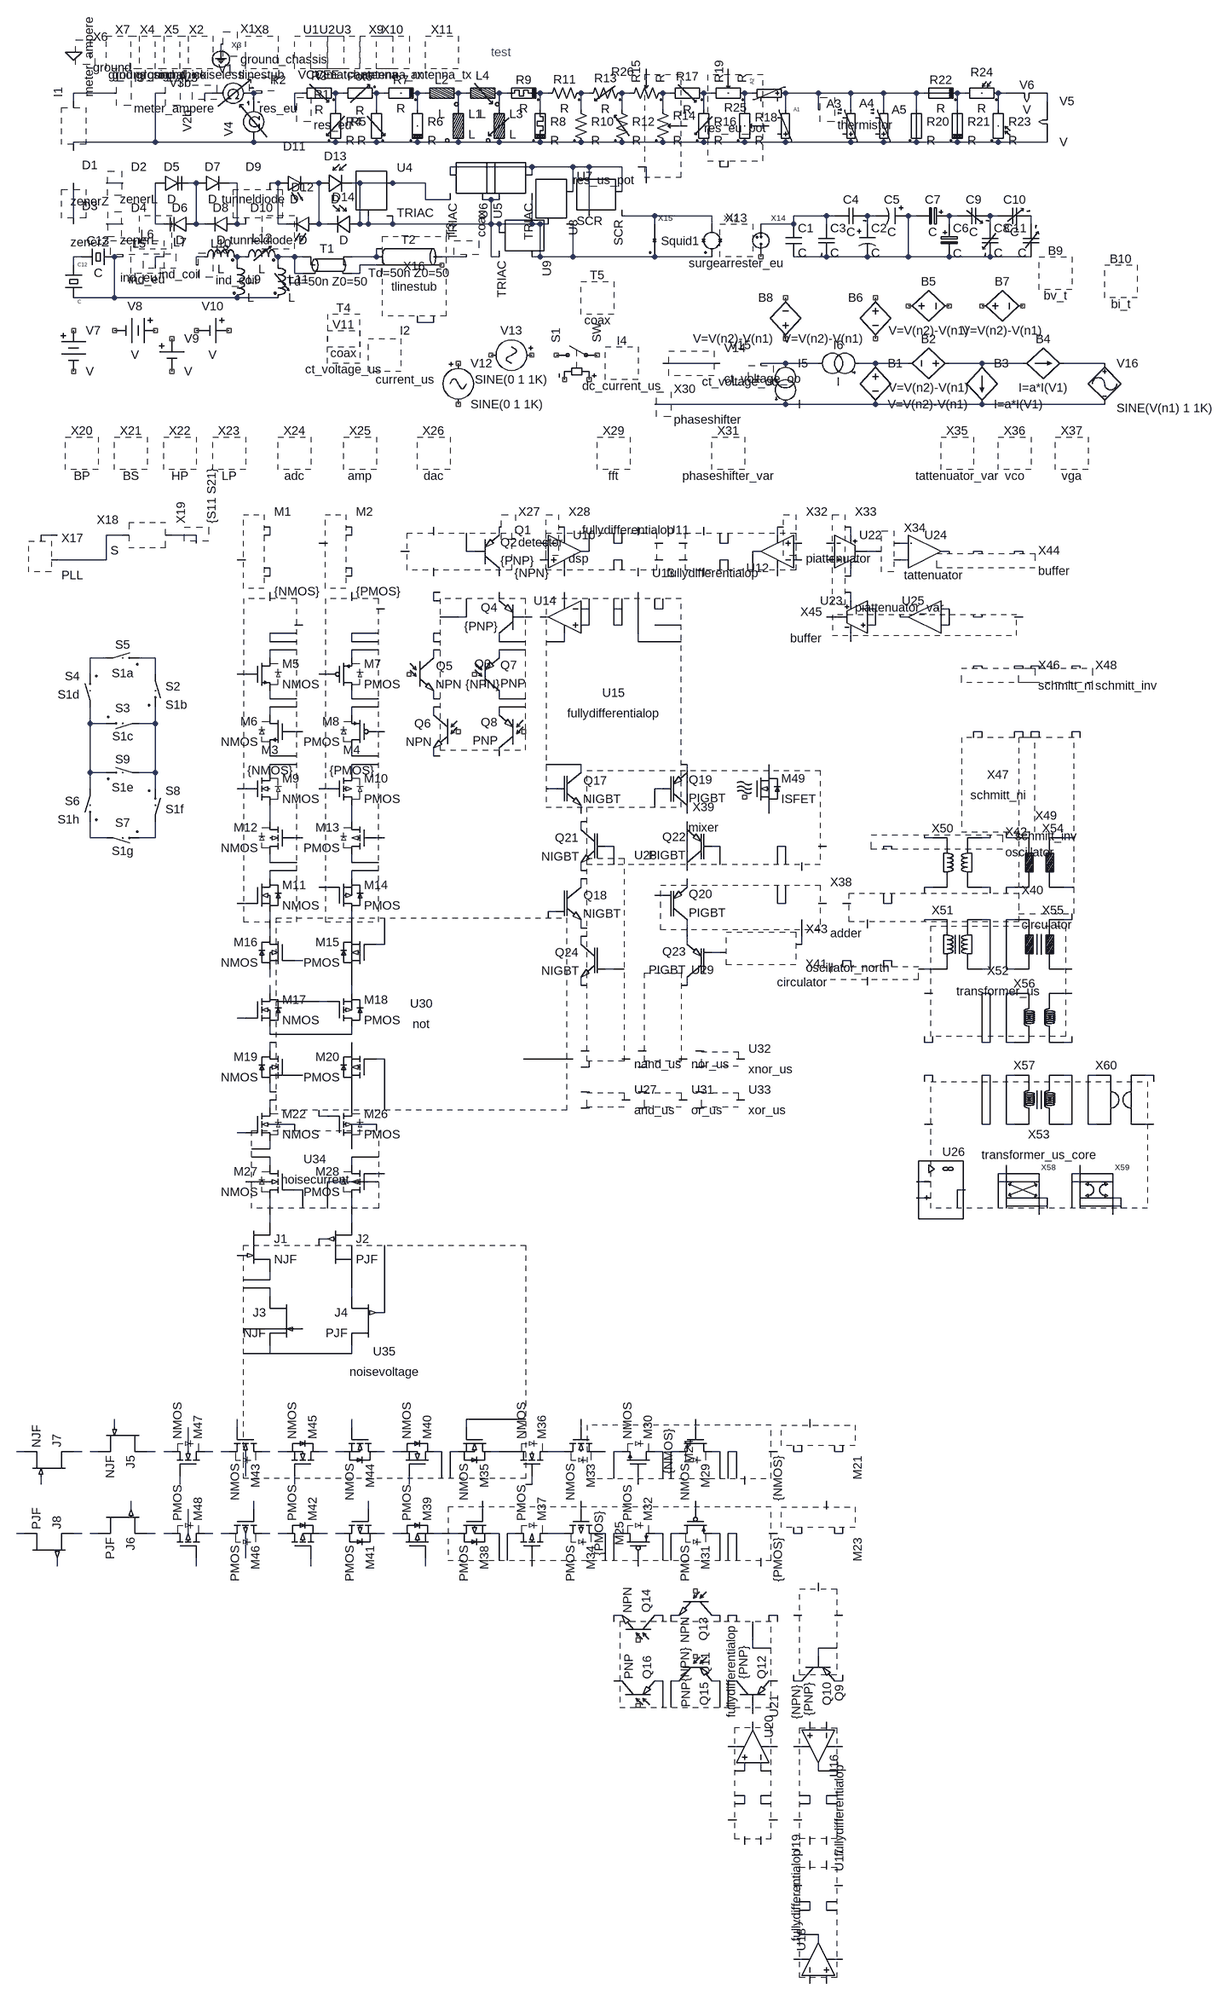
[diagram p0: schematic catalog.asc]
* catalog.asc
* X1: ground_chassis (symbol circuiTikz\ground_chassis not available, pin order unknown); nets seen at it: N001
* X2: ground_noiseless (symbol circuiTikz\ground_noiseless not available, pin order unknown); nets seen at it: 
XX3 N001 ground_protective  ; pins g
* X4: ground_signal (symbol circuiTikz\ground_signal not available, pin order unknown); nets seen at it: 
* X5: ground_thick (symbol circuiTikz\ground_thick not available, pin order unknown); nets seen at it: 
* X6: ground (symbol circuiTikz\ground not available, pin order unknown); nets seen at it: 0
* X7: gnd (symbol circuiTikz\gnd not available, pin order unknown); nets seen at it: 
* U1: VCC (symbol circuiTikz\vcc not available, pin order unknown); nets seen at it: 
* U2: VEE (symbol circuiTikz\vee not available, pin order unknown); nets seen at it: 
* X8: tlinestub (symbol circuiTikz\tlinestub not available, pin order unknown); nets seen at it: 
* U3: match (symbol circuiTikz\match not available, pin order unknown); nets seen at it: 
* X9: antenna (symbol circuiTikz\antenna not available, pin order unknown); nets seen at it: 
* X10: antenna_rx (symbol circuiTikz\antenna_rx not available, pin order unknown); nets seen at it: 
* X11: antenna_tx (symbol circuiTikz\antenna_tx not available, pin order unknown); nets seen at it: 
* I3: meter_ampere (symbol circuiTikz\meter_ampere not available, pin order unknown); nets seen at it: N004
* I1: meter_ampere (symbol circuiTikz\meter_ampere not available, pin order unknown); nets seen at it: N004, N005
* V3: V3b (symbol circuiTikz\ct_voltmeter not available, pin order unknown); nets seen at it: N005
* V2: V2b (symbol circuiTikz\ct_voltmeter not available, pin order unknown); nets seen at it: N006
V1 N006 N007
V4 N005 N007
* R1: res_eu (symbol circuiTikz\res_eu not available, pin order unknown); nets seen at it: N008
* R2: res_eu (symbol circuiTikz\res_eu not available, pin order unknown); nets seen at it: N007
R3 N008 N009 R
R4 N009 N005 R
R5 N010 N005 R
R§Pot6 N009 N010 R
R6 N011 N005 R
R7 N010 N011 R
L1 N012 N005 L
L2 N011 N012 L
L3 N013 N005 L
L4 N012 N013 L
R8 N014 N005 R
R9 N013 N014 R
R10 N015 N005 R
R11 N014 N015 R
R12 N016 N005 R
R13 N015 N016 R
R14 N017 N005 N024 R
R15 N016 N017 N002 R
R16 N018 N005 R
R17 N017 N018 R
R18 N019 N005 N025 R
R19 N018 N019 N003 R
A1 N005 N005 N005 N005 N005 N005 N020 N005 VARISTOR
A2 N020 N020 N020 N020 N020 N020 N019 N020 VARISTOR
* A3: thermistor (symbol circuiTikz\thermistor not available, pin order unknown); nets seen at it: N020
A4 N005 N005 N005 N005 N005 N005 N020 N005 VARISTOR
A5 N005 N005 N005 N005 N005 N005 N020 N005 VARISTOR
R20 N020 N005 R
R21 N021 N005 R
R22 N020 N021 R
R23 N022 N005 R
R24 N021 N022 R
* R25: res_eu_pot (symbol circuiTikz\res_eu_pot not available, pin order unknown); nets seen at it: N003, N025, N028
* R26: res_us_pot (symbol circuiTikz\res_us_pot not available, pin order unknown); nets seen at it: N002, N024, N027
V5 N023 N005 V
V6 N022 N023 V
* D1: zenerZ (symbol circuiTikz\zenerZ not available, pin order unknown); nets seen at it: N041
* D2: zenerL (symbol circuiTikz\zenerL not available, pin order unknown); nets seen at it: N029
* D3: zenerZ (symbol circuiTikz\zenerZ not available, pin order unknown); nets seen at it: N042
* D4: zenerL (symbol circuiTikz\zenerL not available, pin order unknown); nets seen at it: 
D5 N043 N030 D
D6 N030 N043 D
D7 N030 N031 D
D8 N031 N030 D
* D9: tunneldiode (symbol circuiTikz\tunneldiode not available, pin order unknown); nets seen at it: N031, N032
* D10: tunneldiode (symbol circuiTikz\tunneldiode not available, pin order unknown); nets seen at it: 
D11 N032 N033 D
D12 N033 N032 D
D13 N033 N034 D
D14 N034 N033 D
XU4 N034 N034 N034 TRIAC  ; pins MT2 G MT1
XU5 N034 N026 N034 TRIAC  ; pins MT2 G MT1
XU6 N034 N026 N034 TRIAC  ; pins MT2 G MT1
XU7 N026 N034 N034 SCR  ; pins A G K
* U8: SCR (symbol Misc\SCR not certain, pin order unknown); nets seen at it: N026, N035
XU9 N034 N034 N034 TRIAC  ; pins MT2 G MT1
XX12 N035 N034 squid params: Squid1  ; pins + -
* X13: surgearrester_eu (symbol circuiTikz\surgearrester_eu not available, pin order unknown); nets seen at it: 
XX14 N036 NC_01 surgearrester_us  ; pins + -
XX15 N035 N034 barrier  ; pins + -
C1 N036 N038 C
C3 N036 N038 C
C4 N036 N037 C
C6 N039 N038 C
C7 N039 N038 C
C2 N037 N038 C
C5 N038 N037 C
C8 N040 N038 C
C9 N039 N040 C
C10 N040 N044 C
C11 N038 N044 C
C12 N045 N046 C
C13 N046 N045 C
* L5: ind_eu (symbol circuiTikz\ind_eu not available, pin order unknown); nets seen at it: N046
* L7: ind_coil (symbol circuiTikz\ind_coil not available, pin order unknown); nets seen at it: N047
* L6: ind_eu (symbol circuiTikz\ind_eu not available, pin order unknown); nets seen at it: 
* L8: ind_coil (symbol circuiTikz\ind_coil not available, pin order unknown); nets seen at it: N048
L9 N049 N046 L
L10 N048 N049 L
L11 N050 N046 L
L12 N049 N050 L
T1 N050 N050 N051 N053 Td=50n Z0=50
T2 N051 N053 N052 NC_02 Td=50n Z0=50
* T3: coax (symbol circuiTikz\coax not available, pin order unknown); nets seen at it: N052
* X16: tlinestub (symbol circuiTikz\tlinestub not available, pin order unknown); nets seen at it: N051, N054
* T4: coax (symbol circuiTikz\coax not available, pin order unknown); nets seen at it: 
* T5: coax (symbol circuiTikz\coax not available, pin order unknown); nets seen at it: 
V7 NC_03 NC_04 V
V8 NC_05 NC_06 V
V9 NC_07 NC_08 V
V10 NC_09 NC_10 V
* V11: ct_voltage_us (symbol circuiTikz\ct_voltage_us not available, pin order unknown); nets seen at it: 
* I2: current_us (symbol circuiTikz\current_us not available, pin order unknown); nets seen at it: 
V12 NC_11 NC_12 SINE(0 1 1K)
V13 NC_13 NC_14 SINE(0 1 1K)
S1 NC_15 NC_16 NC_17 NC_18 SW
* I4: dc_current_us (symbol circuiTikz\dc_current_us not available, pin order unknown); nets seen at it: 
* X17: PLL (symbol circuiTikz\blockdiagram\twoport not available, pin order unknown); nets seen at it: N061, N062
* X18: S (symbol circuiTikz\blockdiagram\twoport not available, pin order unknown); nets seen at it: N062, N063
* X19: {S11 S21} (symbol circuiTikz\blockdiagram\twoport not available, pin order unknown); nets seen at it: N063
* X20: BP (symbol circuiTikz\blockdiagram\bandpass not available, pin order unknown); nets seen at it: 
* X21: BS (symbol circuiTikz\blockdiagram\bandstop not available, pin order unknown); nets seen at it: 
* X22: HP (symbol circuiTikz\blockdiagram\highpass not available, pin order unknown); nets seen at it: 
* X23: LP (symbol circuiTikz\blockdiagram\lowpass not available, pin order unknown); nets seen at it: 
* X24: adc (symbol circuiTikz\blockdiagram\adc not available, pin order unknown); nets seen at it: 
* X25: amp (symbol circuiTikz\blockdiagram\amp not available, pin order unknown); nets seen at it: 
* X26: dac (symbol circuiTikz\blockdiagram\dac not available, pin order unknown); nets seen at it: 
* X27: detector (symbol circuiTikz\blockdiagram\detector not available, pin order unknown); nets seen at it: N067
* X28: dsp (symbol circuiTikz\blockdiagram\dsp not available, pin order unknown); nets seen at it: N068, N074
* X29: fft (symbol circuiTikz\blockdiagram\fft not available, pin order unknown); nets seen at it: 
* X30: phaseshifter (symbol circuiTikz\blockdiagram\phaseshifter not available, pin order unknown); nets seen at it: N060
* X31: phaseshifter_var (symbol circuiTikz\blockdiagram\phaseshifter_var not available, pin order unknown); nets seen at it: 
* X32: piattenuator (symbol circuiTikz\blockdiagram\piattenuator not available, pin order unknown); nets seen at it: N071, N079
* X33: piattenuator_var (symbol circuiTikz\blockdiagram\piattenuator_var not available, pin order unknown); nets seen at it: N072, N080, N097, N107, N114
* X34: tattenuator (symbol circuiTikz\blockdiagram\tattenuator not available, pin order unknown); nets seen at it: N081, N086, N098
* X35: tattenuator_var (symbol circuiTikz\blockdiagram\tattenuator_var not available, pin order unknown); nets seen at it: 
* X36: vco (symbol circuiTikz\blockdiagram\vco not available, pin order unknown); nets seen at it: 
* X37: vga (symbol circuiTikz\blockdiagram\vga not available, pin order unknown); nets seen at it: 
* M1: {NMOS} (symbol circuiTikz\nmos_t not available, pin order unknown); nets seen at it: N064, N090, N099
* M2: {PMOS} (symbol circuiTikz\pmos_t not available, pin order unknown); nets seen at it: N065, N073, N100
* Q1: {NPN} (symbol circuiTikz\npn_t not available, pin order unknown); nets seen at it: N066, N082, N083, N101, N102
Q2 N102 N083 N067 0 {PNP}
XU10 N091 N074 N068 N103 N084 level.2 Avol=1Meg GBW=10Meg Slew=10Meg ilimit=25m rail=0 Vos=0 phimargin=45 en=0 enk=0 in=0 ink=0 Rin=500Meg  ; pins IN+ IN- V+ V- OUT
* U11: fullydifferentialop (symbol Opamps\differential\fullydifferentialop not available, pin order unknown); nets seen at it: N069, N075, N076, N084, N091, N092, N093, N103, N104
XU12 N079 N096 N106 N071 N085 level.2 Avol=1Meg GBW=10Meg Slew=10Meg ilimit=25m rail=0 Vos=0 phimargin=45 en=0 enk=0 in=0 ink=0 Rin=500Meg  ; pins IN+ IN- V+ V- OUT
* U13: fullydifferentialop (symbol Opamps\differential\fullydifferentialop not available, pin order unknown); nets seen at it: N070, N077, N078, N085, N094, N095, N096, N105, N106
XU14 N129 N116 N112 N138 N123 level.2 Avol=1Meg GBW=10Meg Slew=10Meg ilimit=25m rail=0 Vos=0 phimargin=45 en=0 enk=0 in=0 ink=0 Rin=500Meg  ; pins IN+ IN- V+ V- OUT
* U15: fullydifferentialop (symbol Opamps\differential\fullydifferentialop not available, pin order unknown); nets seen at it: N112, N113, N116, N117, N118, N123, N129, N130, N131, N138, N139, N175, N176, N180, N181, N182
* M3: {NMOS} (symbol circuiTikz\nmos_t not available, pin order unknown); nets seen at it: N108, N128, N134, N143, N151, N153, N157, N163, N169, N173, N178, N191, N202, N207, N217, N223, N233
* M4: {PMOS} (symbol circuiTikz\pmos_t not available, pin order unknown); nets seen at it: N109, N115, N135, N144, N152, N154, N158, N164, N170, N174, N179, N192, N203, N208, N209, N224, N234
* Q3: {NPN} (symbol circuiTikz\npn_t not available, pin order unknown); nets seen at it: N110, N111, N121, N122, N136, N137, N145, N146, N155, N156, N159, N160, N171, N172
Q4 N137 N122 N111 0 {PNP}
* V14: ct_voltage_oo (symbol circuiTikz\ct_voltage_oo not available, pin order unknown); nets seen at it: N055
I5 N056 N060 I
* V15: ct_voltage_oo (symbol circuiTikz\ct_voltage_oo not available, pin order unknown); nets seen at it: N056
I6 N056 N057 I
B1 N057 N060 V=V(n2)-V(n1)
B2 N058 N057 V=V(n2)-V(n1)
B3 N058 N060 I=a*I(V1)
B4 N058 N059 I=a*I(V1)
B5 NC_19 NC_20 V=V(n2)-V(n1)
B6 NC_21 NC_22 V=V(n2)-V(n1)
B7 NC_23 NC_24 V=V(n2)-V(n1)
B8 NC_25 NC_26 V=V(n2)-V(n1)
* B9: bv_t (symbol circuiTikz\bv_t not available, pin order unknown); nets seen at it: 
* B10: bi_t (symbol circuiTikz\bi_t not available, pin order unknown); nets seen at it: 
M5 N143 N151 N153 N153 NMOS
M6 N157 N163 N169 N169 NMOS
M7 N154 N152 N144 N144 PMOS
M8 N170 N164 N158 N158 PMOS
Q5 N145 NC_27 N155 0 NPN
Q6 N159 NC_28 N171 0 NPN
Q7 N156 NC_29 N146 0 PNP
Q8 N172 NC_30 N160 0 PNP
M9 N173 N178 N185 N185 NMOS
M10 N186 N179 N174 N174 PMOS
M11 N207 N217 N223 N223 NMOS
M12 N185 N191 N202 N202 NMOS
M13 N203 N192 N186 N186 PMOS
M14 N224 N209 N208 N208 PMOS
M15 N249 N235 N234 N234 PMOS
M16 N233 N240 N248 N248 NMOS
M18 N262 N259 N254 N254 PMOS
M20 N289 N272 N268 N268 PMOS
M22 N296 N310 N311 N311 NMOS
M17 N253 N260 N261 N261 NMOS
M19 N267 N281 N288 N288 NMOS
M26 N312 N301 N297 N297 PMOS
M27 N313 N323 N328 N328 NMOS
M28 N329 N315 N314 N314 PMOS
J1 N332 N335 N336 NJF
J2 N333 N334 N337 PJF
J3 N338 N341 N342 NJF
J4 N339 N340 N343 PJF
* M21: {NMOS} (symbol circuiTikz\nmos_t not available, pin order unknown); nets seen at it: N350, N377, N378
* M23: {PMOS} (symbol circuiTikz\pmos_t not available, pin order unknown); nets seen at it: N393, N420, N421
* Q9: {NPN} (symbol circuiTikz\npn_t not available, pin order unknown); nets seen at it: N430, N437, N438, N440, N447, N448
Q10 N447 N440 N448 0 {PNP}
XU16 N451 N452 N456 N455 N459 level.2 Avol=1Meg GBW=10Meg Slew=10Meg ilimit=25m rail=0 Vos=0 phimargin=45 en=0 enk=0 in=0 ink=0 Rin=500Meg  ; pins IN+ IN- V+ V- OUT
* U17: fullydifferentialop (symbol Opamps\differential\fullydifferentialop not available, pin order unknown); nets seen at it: N451, N452, N455, N456, N459, N462, N463, N466, N467, N470, N471
XU18 N482 N481 N479 N480 N478 level.2 Avol=1Meg GBW=10Meg Slew=10Meg ilimit=25m rail=0 Vos=0 phimargin=45 en=0 enk=0 in=0 ink=0 Rin=500Meg  ; pins IN+ IN- V+ V- OUT
* U19: fullydifferentialop (symbol Opamps\differential\fullydifferentialop not available, pin order unknown); nets seen at it: N472, N473, N474, N475, N476, N477, N478, N479, N480, N481, N482
XU20 N457 N458 N454 N453 N450 level.2 Avol=1Meg GBW=10Meg Slew=10Meg ilimit=25m rail=0 Vos=0 phimargin=45 en=0 enk=0 in=0 ink=0 Rin=500Meg  ; pins IN+ IN- V+ V- OUT
* U21: fullydifferentialop (symbol Opamps\differential\fullydifferentialop not available, pin order unknown); nets seen at it: N450, N453, N454, N457, N458, N460, N461, N464, N465, N468, N469
* M24: {NMOS} (symbol circuiTikz\nmos_t not available, pin order unknown); nets seen at it: N348, N349, N370, N371, N372, N373, N374, N375, N376, N385, N386
* M25: {PMOS} (symbol circuiTikz\pmos_t not available, pin order unknown); nets seen at it: N390, N391, N392, N408, N409, N410, N411, N413, N414, N415, N416, N417, N418, N419, N427, N428, N429
* Q11: {NPN} (symbol circuiTikz\npn_t not available, pin order unknown); nets seen at it: N431, N432, N433, N434, N435, N436, N439, N441, N442, N443, N444, N445, N446, N449
Q12 N445 N449 N446 0 {PNP}
M29 N374 N349 N373 N373 NMOS
M30 N372 N385 N371 N371 NMOS
M31 N416 N392 N417 N417 PMOS
M32 N414 N428 N415 N415 PMOS
Q13 N434 NC_31 N433 0 NPN
Q14 N432 NC_32 N431 0 NPN
Q15 N443 NC_33 N444 0 PNP
Q16 N441 NC_34 N442 0 PNP
M33 N370 N348 N369 N369 NMOS
M34 N412 N391 N413 N413 PMOS
M35 N367 N347 N366 N366 NMOS
M36 N369 N384 N368 N368 NMOS
M37 N411 N427 N412 N412 PMOS
M38 N409 N390 N410 N410 PMOS
M39 N407 N426 N408 N408 PMOS
M40 N365 N383 N364 N364 NMOS
M41 N405 N389 N406 N406 PMOS
M42 N403 N425 N404 N404 PMOS
M43 N359 N345 N358 N358 NMOS
M44 N363 N346 N362 N362 NMOS
M45 N361 N382 N360 N360 NMOS
M46 N401 N388 N402 N402 PMOS
M47 N357 N381 N355 N355 NMOS
M48 N398 N424 N400 N400 PMOS
J5 N354 N344 N353 NJF
J6 N397 N387 N396 PJF
J7 N352 N380 N351 NJF
J8 N395 N423 N394 PJF
V16 N059 N060 SINE(V(n1) 1 1K)
Q17 N175 N180 N182 0 NIGBT
Q18 N210 N222 N229 0 NIGBT
Q19 N183 N181 N176 0 PIGBT
Q20 N230 N216 N211 0 PIGBT
Q21 N187 N197 N204 0 NIGBT
Q22 N205 N198 N188 0 PIGBT
Q23 N251 N239 N237 0 PIGBT
Q24 N236 N243 N250 0 NIGBT
M49 N177 NC_35 N184 N184 ISFET
* X39: mixer (symbol circuiTikz\blockdiagram\mixer not available, pin order unknown); nets seen at it: N177, N183, N184, N187, N188, N197, N198, N199, N200, N205, N206
* X38: adder (symbol circuiTikz\blockdiagram\adder not available, pin order unknown); nets seen at it: N211, N216, N218, N219, N230, N231, N237, N238
* X40: circulator (symbol circuiTikz\blockdiagram\circulator not available, pin order unknown); nets seen at it: N212, N213, N214, N220, N221, N225, N232
* X41: circulator (symbol circuiTikz\blockdiagram\circulator not available, pin order unknown); nets seen at it: N241, N242, N244, N252
* X42: oscillator (symbol circuiTikz\blockdiagram\oscillator not available, pin order unknown); nets seen at it: N193, N194, N201
* X43: oscillator_north (symbol circuiTikz\blockdiagram\oscillator_north not available, pin order unknown); nets seen at it: N238, N239
XU22 N097 N080 N072 N107 N086 level.2 Avol=1Meg GBW=10Meg Slew=10Meg ilimit=25m rail=0 Vos=0 phimargin=45 en=0 enk=0 in=0 ink=0 Rin=500Meg  ; pins In+ In- V+ V- OUT
XU23 N132 N119 N114 N140 N124 level.2 Avol=1Meg GBW=10Meg Slew=10Meg ilimit=25m rail=0 Vos=0 phimargin=45 en=0 enk=0 in=0 ink=0 Rin=500Meg  ; pins In+ In- V+ V- OUT
XU24 N081 N098 N087 opamp Aol=100K GBW=10Meg  ; pins invin noninvin out
XU25 N120 N133 N125 opamp Aol=100K GBW=10Meg  ; pins invin noninvin out
* X44: buffer (symbol circuiTikz\blockdiagram\buffer not available, pin order unknown); nets seen at it: N087, N088, N089
* X45: buffer (symbol circuiTikz\blockdiagram\buffer not available, pin order unknown); nets seen at it: N119, N120, N124, N125, N126, N127, N132, N133, N140
* X48: schmitt_inv (symbol circuiTikz\blockdiagram\schmitt_inv not available, pin order unknown); nets seen at it: N149, N150
* X49: schmitt_inv (symbol circuiTikz\blockdiagram\schmitt_inv not available, pin order unknown); nets seen at it: N167, N168, N196, N215, N228
* X46: schmitt_ni (symbol circuiTikz\blockdiagram\schmitt_ni not available, pin order unknown); nets seen at it: N147, N148
* X47: schmitt_ni (symbol circuiTikz\blockdiagram\schmitt_ni not available, pin order unknown); nets seen at it: N165, N166, N195
XX50 N193 N212 N194 N213 transformer  ; pins p1 p2 s1 s2
XX51 N225 N244 N226 N245 transformer_core  ; pins p1 p2 s1 s2
XX54 N195 N214 N196 N215 transformer_eu  ; pins p1 p2 s1 s2
XX55 N227 N246 N228 N247 transformer_eu_core  ; pins p1 p2 s1 s2
* X52: transformer_us (symbol circuiTikz\transformer_us not available, pin order unknown); nets seen at it: N226, N227, N245, N246, N247, N255, N256, N257, N258, N263, N264, N265, N266
* X53: transformer_us_core (symbol circuiTikz\transformer_us_core not available, pin order unknown); nets seen at it: N282, N283, N284, N285, N286, N287, N304, N305, N306, N307, N308, N309, N316, N317, N320, N321, N322, N324, N325, N326, N327, N330, N331
XX56 N257 N265 N258 N266 transformer_cu  ; pins p1 p2 s1 s2
XX57 N284 N306 N285 N307 transformer_cu_core  ; pins p1 p2 s1 s2
XU26 N325 N320 N324 level.2 Avol=1Meg GBW=10Meg Slew=10Meg ilimit=25m rail=0 Vos=0 phimargin=45 en=0 enk=0 in=0 ink=0 Rin=500Meg  ; pins In+ In- OUT
XX58 coupler
* U27: and_us (symbol circuiTikz\logic\and_us not available, pin order unknown); nets seen at it: N290, N293, N298
* U28: nand_us (symbol circuiTikz\logic\nand_us not available, pin order unknown); nets seen at it: N204, N210, N229, N236, N243, N250, N269, N275, N278
* U29: nor_us (symbol circuiTikz\logic\nor_us not available, pin order unknown); nets seen at it: N251, N270, N276, N279
* U30: not (symbol circuiTikz\logic\not not available, pin order unknown); nets seen at it: N222, N235, N249, N254, N259, N261, N262, N267, N268, N272, N273, N274, N281, N288, N289, N296, N297, N301
* U31: or_us (symbol circuiTikz\logic\or_us not available, pin order unknown); nets seen at it: N291, N294, N299
* U32: xnor_us (symbol circuiTikz\logic\xnor_us not available, pin order unknown); nets seen at it: N271, N277, N280
* U33: xor_us (symbol circuiTikz\logic\xor_us not available, pin order unknown); nets seen at it: N292, N295, N300
XX59 coupler2
XX60 N286 N308 N287 N309 gyrator  ; pins p1 p2 s1 s2
S2 N142 N162 S1b
S3 N162 N161 S1c
S4 N161 N141 S1d
S5 N141 N142 S1a
S6 N161 N189 S1h
S7 N189 N190 S1g
S8 N190 N162 S1f
S9 N162 N161 S1e
* U34: noisecurrent (symbol circuiTikz\noisecurrent not available, pin order unknown); nets seen at it: N302, N303, N311, N312, N313, N314, N315, N318, N319, N323, N328, N329, N332, N333
* U35: noisevoltage (symbol circuiTikz\noisevoltage not available, pin order unknown); nets seen at it: N334, N335, N336, N337, N338, N339, N340, N341, N343, N347, N365, N366, N367, N368, N384
.model D D
.lib standard.dio
.model NPN NPN
.model PNP PNP
.lib standard.bjt
.model NJF NJF
.model PJF PJF
.lib standard.jft
.model NMOS NMOS
.model PMOS PMOS
.lib standard.mos
* test
.lib UniversalOpamps2.sub
.backanno
.end